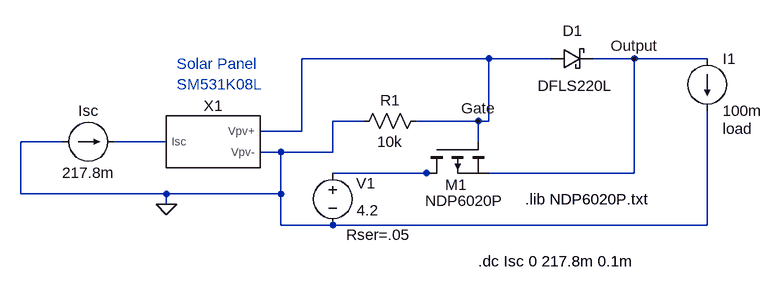
[diagram p0: schematic StandardCircuit.asc]
StandardCircuit.asc, the LTspice schematic file:
Version 4
SHEET 1 1416 680
WIRE 528 48 240 48
WIRE 624 48 528 48
WIRE 752 48 688 48
WIRE 864 48 752 48
WIRE 336 144 288 144
WIRE 512 144 416 144
WIRE 528 144 528 48
WIRE 528 144 512 144
WIRE 240 160 240 48
WIRE 240 160 176 160
WIRE -128 176 -192 176
WIRE 32 176 -48 176
WIRE 512 176 512 144
WIRE 208 192 176 192
WIRE 288 192 288 144
WIRE 288 192 208 192
WIRE 432 224 288 224
WIRE 448 224 432 224
WIRE 752 224 752 48
WIRE 752 224 528 224
WIRE -192 256 -192 176
WIRE 32 256 -192 256
WIRE 208 256 208 192
WIRE 208 256 32 256
WIRE 32 272 32 256
WIRE 208 304 208 256
WIRE 288 304 208 304
WIRE 864 304 864 128
WIRE 864 304 288 304
FLAG 32 272 0
FLAG 752 48 Output
FLAG 512 144 Gate
SYMBOL current -128 176 R270
WINDOW 0 32 40 VTop 2
WINDOW 3 -32 40 VBottom 2
WINDOW 123 0 0 Left 0
WINDOW 39 0 0 Left 0
SYMATTR InstName Isc
SYMATTR Value 217.8m
SYMBOL SolarPanel 96 176 R0
SYMATTR InstName X1
SYMBOL voltage 288 208 R0
WINDOW 0 36 32 Left 2
WINDOW 3 37 73 Left 2
WINDOW 123 0 0 Left 0
WINDOW 39 21 111 Left 2
SYMATTR InstName V1
SYMATTR Value 4.2
SYMATTR SpiceLine Rser=.05
SYMBOL schottky 624 64 R270
WINDOW 0 43 33 VTop 2
WINDOW 3 -10 37 VBottom 2
SYMATTR InstName D1
SYMATTR Value DFLS220L
SYMATTR Description Diode
SYMATTR Type diode
SYMBOL res 432 128 R90
WINDOW 0 0 56 VBottom 2
WINDOW 3 32 56 VTop 2
SYMATTR InstName R1
SYMATTR Value 10k
SYMBOL current 864 48 R0
WINDOW 123 0 0 Left 0
WINDOW 39 24 108 Left 2
SYMATTR SpiceLine load
SYMATTR InstName I1
SYMATTR Value 100m
SYMBOL pmos 432 176 M90
WINDOW 0 66 63 VLeft 2
WINDOW 3 91 118 VLeft 2
SYMATTR InstName M1
SYMATTR Value NDP6020P
SYMATTR Prefix X
TEXT 584 264 Left 2 !.lib NDP6020P.txt
TEXT 512 360 Left 2 !.dc Isc 0 217.8m 0.1m
TEXT 48 56 Left 2 ;Solar Panel\nSM531K08L

The netlist it stands for:
* StandardCircuit.asc
Isc 0 N001 217.8m
XX1 N001 Gate 0 SolarPanel  ; pins Isc Vpv+ Vpv-
V1 N002 0 4.2 Rser=.05
D1 Gate Output DFLS220L
R1 Gate 0 10k
I1 Output 0 100m load
XM1 N002 Gate Output NDP6020P  ; pins D G S
.model D D
.lib standard.dio
.lib NDP6020P.txt
.dc Isc 0 217.8m 0.1m
* Solar Panel
* SM531K08L
.backanno
.end